# Altium schematic sheet 8050 NPN Transistor SCH.schdoc
size 127 x 101 mm
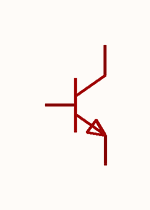
[diagram p0: 8050 NPN Transistor SCH.schdoc]

## Parts
Q?  SS8050-G(RANGE:120-200)  [SOT-23-3_L2.9-W1.3-P1.90-LS2.4-BR]  (value not drawn)

## Nets

Not connected (* = marked no-connect by the designer): Q? 1(B) 2(E) 3(C)

## Library data of the parts
Q? = SS8050-G(RANGE:120-200): TRANS NPN 25V 1.5A SOT-23-3; Manufacturer: CJ(江苏长电/长晶); Add into BOM: yes; Pd - Power Dissipation: 300mW; DC Current Gain: 120@100mA,1V; Transition frequency(fT): 100MHz; Current - Collector Cutoff: 100nA; Vce Saturation(VCE(sat)): 500mV; Symbol: SS8050-G; Device: SS8050-G(RANGE:120-200); LCSC Part Name: L档(120-200); Supplier Part: C164886; Manufacturer Part: SS8050-G(RANGE:120-200); Supplier Footprint: SOT-23; JLCPCB Part Class: Extended Part; Datasheet: https://atta.szlcsc.com/upload/public/pdf/source/20180130/C177739_15172974524031323483.pdf; Supplier: LCSC; Convert to PCB: yes; type: NPN; Operating Temperature: -55℃~+150℃; LCSC Part Number: C164886